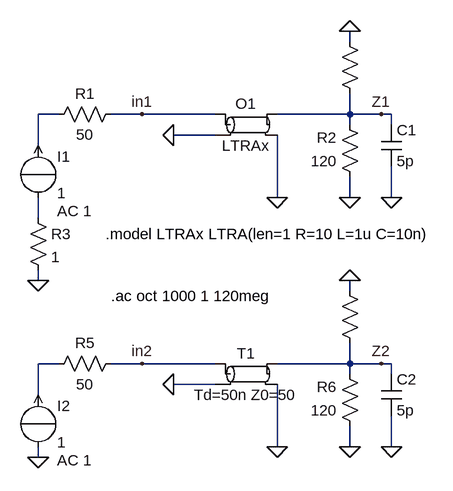
[diagram p0: schematic reflexion.asc]
reflexion.asc, the LTspice schematic file:
Version 4
SHEET 1 880 680
WIRE 288 -368 288 -384
WIRE -160 -256 -192 -256
WIRE -32 -256 -80 -256
WIRE 80 -256 -32 -256
WIRE 288 -256 288 -288
WIRE 288 -256 176 -256
WIRE 336 -256 288 -256
WIRE 352 -256 336 -256
WIRE 288 -240 288 -256
WIRE 352 -240 352 -256
WIRE 80 -224 16 -224
WIRE -192 -208 -192 -256
WIRE 176 -128 176 -224
WIRE 288 -128 288 -160
WIRE 352 -128 352 -176
WIRE -192 -96 -192 -128
WIRE -192 0 -192 -16
WIRE 288 16 288 0
WIRE -160 128 -192 128
WIRE -32 128 -80 128
WIRE 80 128 -32 128
WIRE 288 128 288 96
WIRE 288 128 176 128
WIRE 336 128 288 128
WIRE 352 128 336 128
WIRE 288 144 288 128
WIRE 352 144 352 128
WIRE 80 160 16 160
WIRE -192 176 -192 128
WIRE 176 256 176 160
WIRE 288 256 288 224
WIRE 352 256 352 208
WIRE -192 272 -192 256
FLAG -192 0 0
FLAG 176 -128 0
FLAG 288 -384 0
FLAG 16 -224 0
FLAG 288 -128 0
FLAG 352 -128 0
FLAG 336 -256 Z1
FLAG -192 272 0
FLAG 176 256 0
FLAG 288 0 0
FLAG 16 160 0
FLAG 288 256 0
FLAG 352 256 0
FLAG 336 128 Z2
FLAG -32 -256 in1
FLAG -32 128 in2
SYMBOL source-I -192 -208 R0
WINDOW 123 29 101 Left 2
WINDOW 39 0 0 Left 2
SYMATTR Value2 AC 1
SYMATTR InstName I1
SYMATTR Value 1
SYMBOL res -64 -272 R90
WINDOW 0 0 56 VBottom 2
WINDOW 3 32 56 VTop 2
SYMATTR InstName R1
SYMATTR Value 50
SYMBOL res 304 -144 R180
WINDOW 0 36 76 Left 2
WINDOW 3 36 40 Left 2
SYMATTR InstName R2
SYMATTR Value 120
SYMBOL cap 336 -240 R0
SYMATTR InstName C1
SYMATTR Value 5p
SYMBOL res 272 -384 R0
WINDOW 0 36 40 Invisible 2
WINDOW 3 36 76 Invisible 2
SYMATTR InstName R4
SYMATTR Value 100meg
SYMBOL ltline 128 -240 R0
SYMATTR InstName O1
SYMATTR Value LTRAx
SYMBOL source-I -192 176 R0
WINDOW 123 29 101 Left 2
WINDOW 39 0 0 Left 2
SYMATTR Value2 AC 1
SYMATTR InstName I2
SYMATTR Value 1
SYMBOL res -64 112 R90
WINDOW 0 0 56 VBottom 2
WINDOW 3 32 56 VTop 2
SYMATTR InstName R5
SYMATTR Value 50
SYMBOL res 304 240 R180
WINDOW 0 36 76 Left 2
WINDOW 3 36 40 Left 2
SYMATTR InstName R6
SYMATTR Value 120
SYMBOL cap 336 144 R0
SYMATTR InstName C2
SYMATTR Value 5p
SYMBOL res 272 0 R0
WINDOW 0 36 40 Invisible 2
WINDOW 3 36 76 Invisible 2
SYMATTR InstName R8
SYMATTR Value 100meg
SYMBOL tline 128 144 R0
SYMATTR InstName T1
SYMBOL res -208 -112 R0
SYMATTR InstName R3
SYMATTR Value 1
TEXT -80 24 Left 2 !.ac oct 1000 1 120meg
TEXT -88 -72 Left 2 !.model LTRAx LTRA(len=1 R=10 L=1u C=10n)

The netlist it stands for:
* reflexion.asc
I1 N002 N001 1 AC 1
R1 in1 N001 50
R2 0 Z1 120
C1 Z1 0 5p
R4 0 Z1 100meg
O1 in1 0 Z1 0 LTRAx
I2 0 N003 1 AC 1
R5 in2 N003 50
R6 0 Z2 120
C2 Z2 0 5p
R8 0 Z2 100meg
T1 in2 0 Z2 0 Td=50n Z0=50
R3 N002 0 1
.ac oct 1000 1 120meg
.model LTRAx LTRA(len=1 R=10 L=1u C=10n)
.backanno
.end